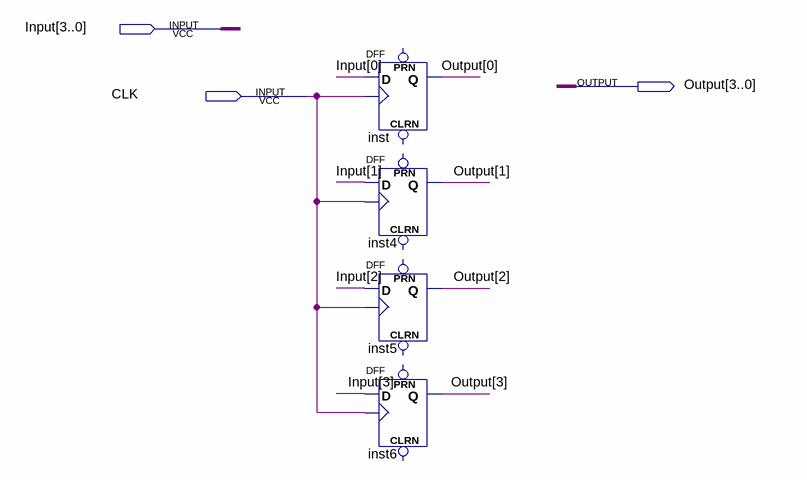
[diagram p0: schematic sheet]
// Quartus schematic state_memory_12.bdf as structural Verilog: 4 symbols, 3 pins
module state_memory_12 (
  input  [3:0] Input,
  input  CLK,
  output [3:0] Output
);

  DFF inst (.CLK(CLK), .D(Input[0]), .Q(Output[0]));  // open: CLRN, PRN
  DFF inst4 (.CLK(CLK), .D(Input[1]), .Q(Output[1]));  // open: CLRN, PRN
  DFF inst5 (.CLK(CLK), .D(Input[2]), .Q(Output[2]));  // open: CLRN, PRN
  DFF inst6 (.CLK(CLK), .D(Input[3]), .Q(Output[3]));  // open: CLRN, PRN
endmodule
